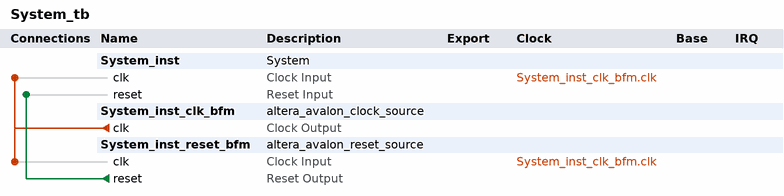
[diagram p0: system contents]
# Platform Designer (Qsys) system System_tb, Cyclone II EP2C35F672C6
# Parameters at their usual value, and those the tool derives, are not listed.
package require -exact qsys 13.0
create_system System_tb
set_project_property DEVICE_FAMILY {Cyclone II}
set_project_property DEVICE EP2C35F672C6

add_instance System_inst System 1.0

add_instance System_inst_clk_bfm altera_avalon_clock_source 13.0

add_instance System_inst_reset_bfm altera_avalon_reset_source 13.0
set_instance_parameter_value System_inst_reset_bfm ASSERT_HIGH_RESET 0
set_instance_parameter_value System_inst_reset_bfm INITIAL_RESET_CYCLES 50

# connections
add_connection System_inst_clk_bfm.clk System_inst.clk clock
add_connection System_inst_clk_bfm.clk System_inst_reset_bfm.clk clock
add_connection System_inst_reset_bfm.reset System_inst.reset reset

set_interconnect_requirement {$system} qsys_mm.clockCrossingAdapter HANDSHAKE
set_interconnect_requirement {$system} qsys_mm.maxAdditionalLatency 1

save_system System_tb.qsys
